# Altium schematic sheet 4ch.SchDoc
size A4; Organization: Altium Limited; Address1: L3, 12a Rodborough Rd; Address2: Frenchs Forest; Address3: NSW; Address4: Australia 2086
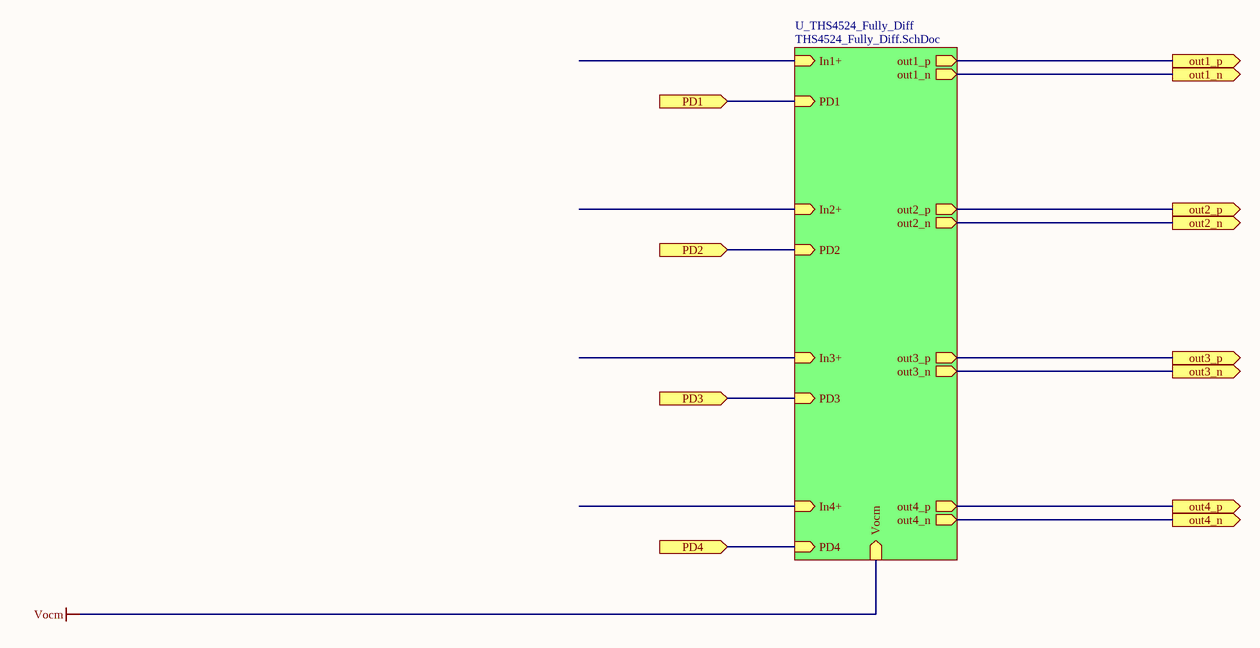
[diagram p0: 4ch.SchDoc]

## Sub-sheets
U_THS4524_Fully_Diff = THS4524_Fully_Diff.SchDoc: Vocm (in), out3_p (out), out3_n (out), out2_p (out), out2_n (out), out1_p (out), out1_n (out), out4_p (out), out4_n (out), In1+ (in), In2+ (in), In3+ (in), In4+ (in), PD1 (in), PD3 (in), PD2 (in), PD4 (in)

## Ports
out1_n (out), out1_p (out), out2_n (out), out2_p (out), out3_n (out), out3_p (out), out4_n (out), out4_p (out), PD1 (in), PD2 (in), PD3 (in), PD4 (in)

## Nets
Vocm: sheet U_THS4524_Fully_Diff/Vocm
out1_n: port out1_n, sheet U_THS4524_Fully_Diff/out1_n
out1_p: port out1_p, sheet U_THS4524_Fully_Diff/out1_p
out2_n: port out2_n, sheet U_THS4524_Fully_Diff/out2_n
out2_p: port out2_p, sheet U_THS4524_Fully_Diff/out2_p
out3_n: port out3_n, sheet U_THS4524_Fully_Diff/out3_n
out3_p: port out3_p, sheet U_THS4524_Fully_Diff/out3_p
out4_n: port out4_n, sheet U_THS4524_Fully_Diff/out4_n
out4_p: port out4_p, sheet U_THS4524_Fully_Diff/out4_p
PD1: port PD1, sheet U_THS4524_Fully_Diff/PD1
PD2: port PD2, sheet U_THS4524_Fully_Diff/PD2
PD3: port PD3, sheet U_THS4524_Fully_Diff/PD3
PD4: port PD4, sheet U_THS4524_Fully_Diff/PD4

## Notes on the sheet
- Project Name:
- Revision:
- File Name:
- Date:
- Nuclear Instruments srl
- Via Lecco, 16, Lambrugo, Italy
- +39 031 2289570
- info@nuclearinstruments.eu
- http://www.nuclearinstruments.eu